# EAGLE design a_Conventional_Boost (EAGLE 9.2.2)
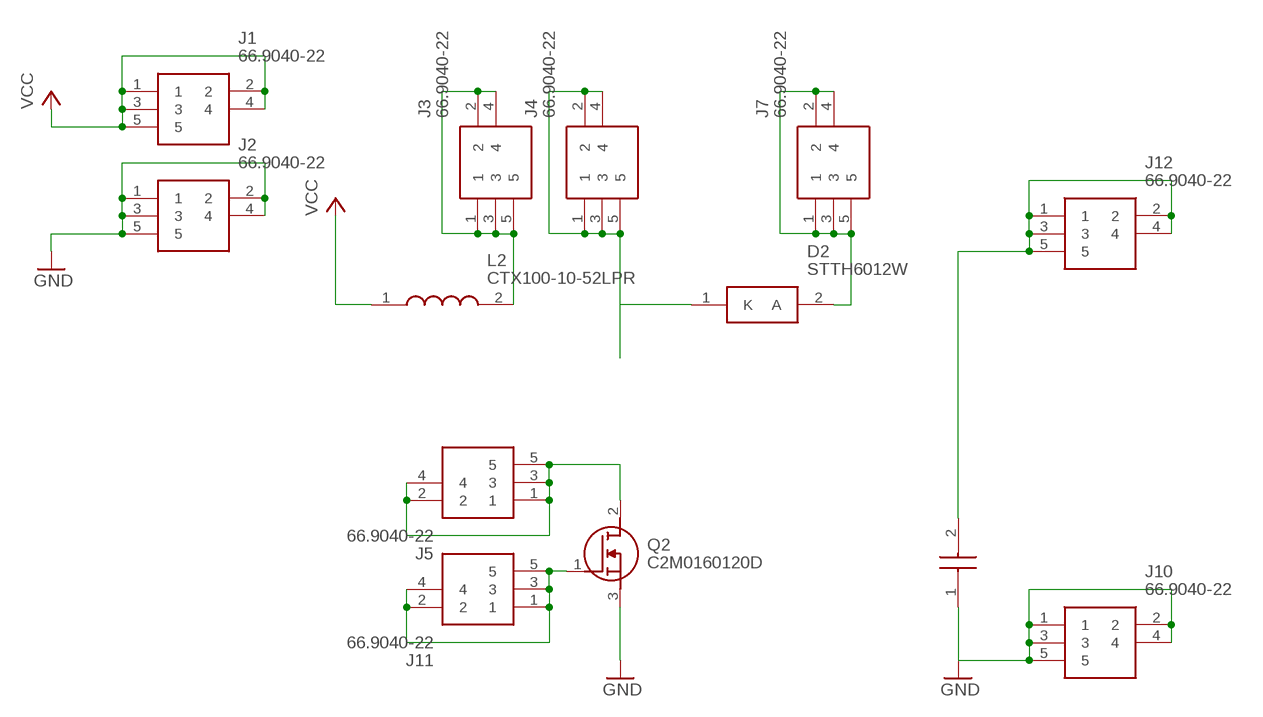
[diagram p0: schematic, sheet 1]

## Parts
D2  STTH6012W  [TO1090P515X1560X2445-2P]
J1  66.9040-22  [66904022]
J2  66.9040-22  [66904022]
J3  66.9040-22  [66904022]
J4  66.9040-22  [66904022]
J5  66.9040-22  [66904022]
J7  66.9040-22  [66904022]
J10  66.9040-22  [66904022]
J11  66.9040-22  [66904022]
J12  66.9040-22  [66904022]
L2  CTX100-10-52LPR  [CTX1001052LPR]
Q2  C2M0160120D  [TO544P521X1594X2550-3P]
U$1  B32774D4505K000  [B32774D4505K000]

## Nets
GND: J2.1 J2.2 J2.3 J2.4 J2.5 J10.1 J10.2 J10.3 J10.4 J10.5 Q2.3(S) U$1.1
GND1: J11.1 J11.2 J11.3 J11.4 J11.5 Q2.1(G)
N$2: D2.1(K) J4.1 J4.2 J4.3 J4.4 J4.5
VCC: J1.1 J1.2 J1.3 J1.4 J1.5 L2.1
VCC1: J3.1 J3.2 J3.3 J3.4 J3.5 L2.2
VCC2: J5.1 J5.2 J5.3 J5.4 J5.5 Q2.2(D)
VCC3: D2.2(A) J7.1 J7.2 J7.3 J7.4 J7.5
VCC4: J12.1 J12.2 J12.3 J12.4 J12.5 U$1.2

## Library data of the parts
D2 = SamacSys_Parts:STTH6012W: STTH6012W, Fast Recovery Rectifier Diode, Switching 60A max, 1200V 125ns, 2-Pin, DO-247 Source: Datasheet <http://www.st.com/web/en/resource/technical/document/datasheet/CD00096472.pdf>; ALLIED_NUMBER: 70014108; ALLIED_PRICE-STOCK: http://www.alliedelec.com/stmicroelectronics-stth6012w/70014108/; ARROW_PART_NUMBER: STTH6012W; ARROW_PRICE-STOCK: https://www.arrow.com/en/products/stth6012w/stmicroelectronics; DESCRIPTION: STTH6012W, Fast Recovery Rectifier Diode, Switching 60A max, 1200V 125ns, 2-Pin, DO-247; HEIGHT: 5.15mm; MANUFACTURER_NAME: STMicroelectronics; MANUFACTURER_PART_NUMBER: STTH6012W; RS_PART_NUMBER: 6870818; RS_PRICE-STOCK: http://uk.rs-online.com/web/p/rectifier-schottky-diodes/6870818/?source=DS
J1-J5 J7 J10-J12 = SamacSys_Parts:66.9040-22: STAUBLI - 66.9040-22 - SOCKET, PCB, 4MM, R/A, RED Source: Datasheet <http://www.farnell.com/datasheets/1479998.pdf>; ALLIED_NUMBER: 70749834; ALLIED_PRICE-STOCK: https://www.alliedelec.com/staubli-66-9040-22/70749834/; ARROW_PART_NUMBER: 66.9040-22; DESCRIPTION: STAUBLI - 66.9040-22 - SOCKET, PCB, 4MM, R/A, RED; HEIGHT: 11mm; MANUFACTURER_NAME: STAUBLI; MANUFACTURER_PART_NUMBER: 66.9040-22
L2 = SamacSys_Parts:CTX100-10-52LPR: Fixed Inductors 100uH 13A Source: Datasheet <http://www.cooperindustries.com/content/dam/public/bussmann/Electronics/Resources/product-datasheets/Bus_Elx_DS_PM 4304_LPCI_Series.pdf>; ARROW_PART_NUMBER: CTX100-10-52LPR; DESCRIPTION: Fixed Inductors 100uH 13A; HEIGHT: 27.5mm; MANUFACTURER_NAME: Eaton; MANUFACTURER_PART_NUMBER: CTX100-10-52LPR
Q2 = SamacSys_Parts:C2M0160120D: Wolfspeed C2M0160120D N-channel SiC MOSFET Transistor, 19 A, 1200 V, 3-Pin TO-247 Source: Datasheet <http://www.wolfspeed.com/media/downloads/169/C2M0160120D.pdf>; ARROW_PART_NUMBER: C2M0160120D; ARROW_PRICE-STOCK: http://uk.rs-online.com/web/p/products/1629709; DESCRIPTION: Wolfspeed C2M0160120D N-channel SiC MOSFET Transistor, 19 A, 1200 V, 3-Pin TO-247; HEIGHT: 5.21mm; MANUFACTURER_NAME: Wolfspeed; MANUFACTURER_PART_NUMBER: C2M0160120D; RS_PART_NUMBER: 1629709; RS_PRICE-STOCK: http://uk.rs-online.com/web/p/products/1629709
U$1 = SamacSys_Parts:B32774D4505K000: Epcos B32774D 5F Polypropylene Film Capacitor 450 V dc 10% Source: Datasheet <https://en.tdk-electronics.tdk.com/inf/20/20/db/fc_2009/MKP_B32774_778.pdf>; ARROW_PART_NUMBER: B32774D4505K000; ARROW_PRICE-STOCK: https://www.arrow.com/en/products/b32774d4505k000/epcos-tdk; DESCRIPTION: Epcos B32774D 5F Polypropylene Film Capacitor 450 V dc 10%; HEIGHT: 21mm; MANUFACTURER_NAME: EPCOS; MANUFACTURER_PART_NUMBER: B32774D4505K000; RS_PART_NUMBER: 1726009; RS_PRICE-STOCK: http://uk.rs-online.com/web/p/products/1726009

## Board
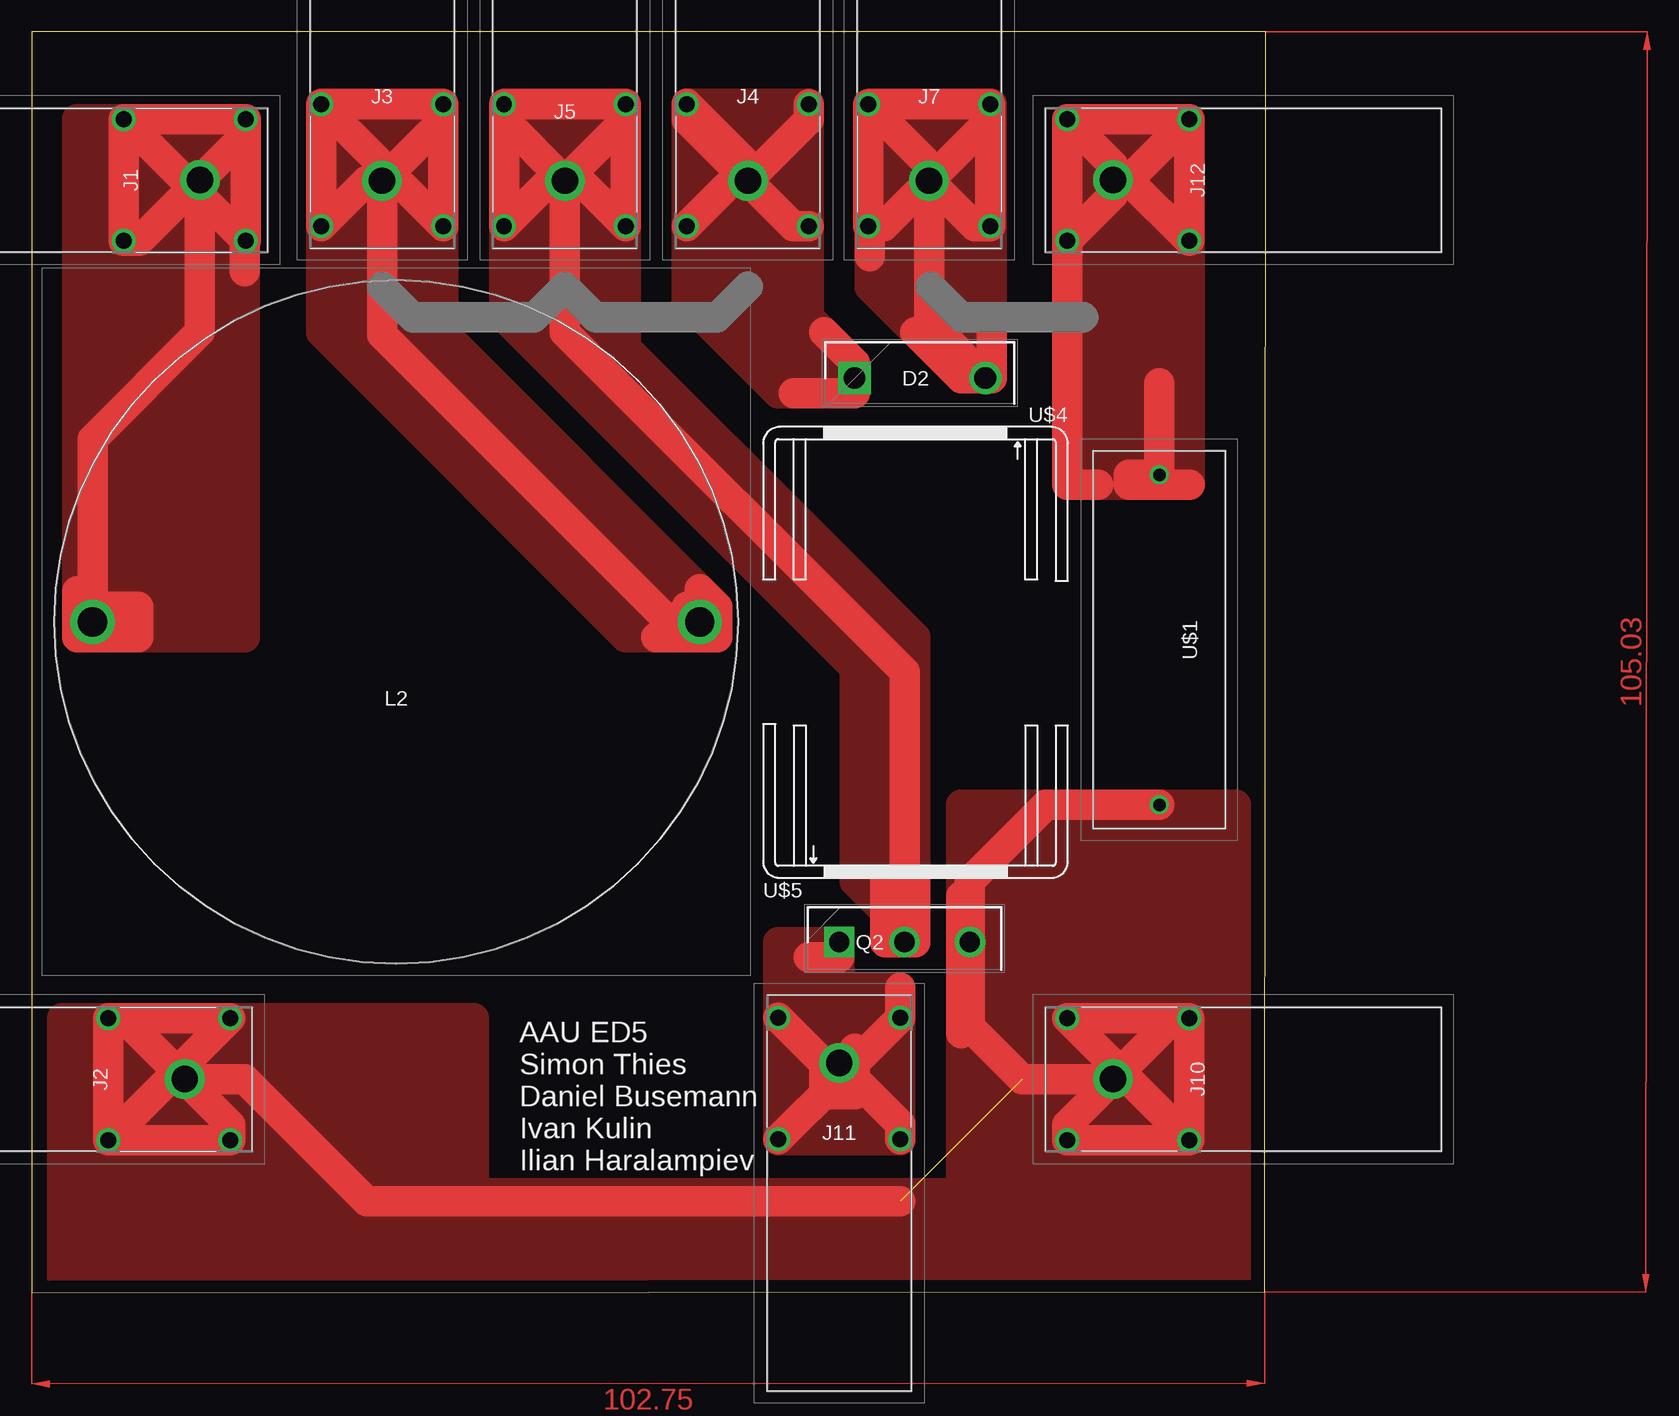
[diagram p1: board, top side]

Size 102.85 x 105.08 mm. Coordinates in mm from the lower left corner, seen from the top.
Outline: 0,0 102.75,0.05 102.85,105.08 0,105.08 0,0
Copper layers (1*16): Top 0.035mm / dielectric 1.5mm / Bottom 0.035mm
Design rules "default": minimum track width 6mil, minimum drill 0.35mm, track to track 6mil, track to pad 6mil, pad to pad 6mil, via to via 6mil, smd to smd 6mil, copper to edge 40mil, drill to drill 6mil, minimum pad ring 10mil, minimum via ring 8mil, stop-mask expansion 4mil, vias tented up to drill 0mil, thermal gap 10mil

### Footprints (pad centres in the part's own frame; a part is rotated, then mirrored left to right if it is on the bottom)
TO1090P515X1560X2445-2P = drill 1.81 pad 2.715 square: 1 0,0 | drill 1.81 pad 2.715: 2 10.9,0
66904022 = drill 1.33 pad 1.995: 1 -5.08,-14.66; 2 5.08,-14.66; 3 5.08,-4.5; 4 -5.08,-4.5 | drill 2.2 pad 3.3: 5 0,-10.86
CTX1001052LPR = drill 2.45 pad 3.675: 1 0,0; 2 50.6,0
TO544P521X1594X2550-3P = drill 1.69 pad 2.535 square: 1 0,0 | drill 1.69 pad 2.535: 2 5.44,0; 3 10.88,0
B32774D4505K000 = drill 1.05 pad 1.575: 1 0,0; 2 27.5,0

### Placement (x,y rotation side)
D2  68.58,76.2 0 top
J1  3.17,92.71 90 top
J2  1.91,17.78 90 top
J3  29.21,103.5 0 top
J4  59.69,103.5 0 top
J5  44.45,103.5 0 top
J7  74.8,103.5 0 top
J10  100.97,17.78 270 top
J11  67.31,8.25 180 top
J12  100.97,92.71 270 top
L2  5.08,55.88 0 top
Q2  67.31,29.21 0 top
U$1  93.98,40.64 90 top
U$4  [FK213]  73.66,71.12 180 top
U$5  [FK213]  73.66,35.56 0 top

### Tracks (layer width: path | path; a pad name or v marks a point on that pad's centre or on a via)
GND  (1 unrouted)
  Top 2.54: J10.5 82.55,17.78 78.19,22.14 Q2.3 | Q2.3 78.19,34.29 84.54,40.64 U$1.1 | 72.39,7.62 27.94,7.62 17.78,17.78 J2.5 | J2.4 J2.1 16.57,13.98 J2.5 | J2.4 J2.3 | J2.3 J2.2 12.77,19.06 J2.5 | J10.4 J10.1 90.11,19.06 J10.5 | J10.3 J10.2 86.31,13.98 J10.5 | J10.3 J10.4 | J10.3 91.39,17.78 J10.5 | J10.5 95.19,22.86 J10.4 | Q2.3 77.47,29.93 | 77.47,29.93 77.47,33.02 | 77.47,29.93 77.47,21.59 | J2.4 11.48,17.78 J2.5 | J2.5 7.68,22.86 J2.3
  pour Top: 77.47,40.64 100.33,40.64 100.33,1.27 77.47,1.27
  pour Top (isolate 1.016): 77.34,1.27 2.54,1.27 2.54,22.86 36.83,22.86 36.83,8.25 77.34,8.25
GND1
  Top 2.54: Q2.1 67.31,27.94 64.77,27.94 | J11.5 67.31,19.05 66.04,19.05 66.04,16.51 68.58,16.51 68.58,20.32 | J11.3 67.31,17.84 J11.5 | J11.5 72.39,14.04 J11.4 | J11.5 68.59,19.12 J11.1 72.39,25.4 | J11.5 66.03,19.12 J11.2
  pour Top (isolate 1.27): 67.31,29.21 67.31,25.4 72.39,25.4 72.39,12.7 62.23,12.7 62.23,29.21
N$2
  Top 2.54: 66.04,80.01 68.58,77.47 D2.1 68.58,74.93 63.5,74.93 | J4.5 58.41,92.64 J4.1 | J4.5 54.61,97.72 54.61,99.06 59.69,93.98 J4.5 | J4.5 64.77,97.72 J4.3 | J4.5 63.49,88.84 J4.2
  pour Top (isolate 1.27): 54.61,99.06 64.77,99.06 64.77,81.28 68.58,77.47 68.58,74.93 62.23,74.93 54.61,82.55
VCC
  Top 2.54: J1.5 14.04,80.08 5.08,71.12 5.08,57.15 8.89,57.15 8.89,54.61 3.81,54.61 3.81,55.88 | J1.1 J1.2 | J1.2 J1.3 | J1.3 J1.4 8.96,87.63 J1.5 | J1.1 17.78,87.63 17.78,85.09 | L2.1 3.81,55.88 | 3.81,55.88 3.81,58.42 | J1.5 17.84,96.51 J1.2 | J1.1 14.04,91.43 J1.5 | J1.3 12.76,92.71 J1.5
  pour Top (isolate 1.27): 17.78,97.79 3.81,97.79 3.81,54.61 17.78,54.61
VCC1
  Top 2.54: J3.5 29.21,79.81 53.14,55.88 L2.2 55.68,58.62 57.15,57.15 57.15,54.61 55.88,54.61 | J3.4 J3.1 27.93,92.64 J3.5 | J3.4 J3.3 | J3.3 J3.2 29.21,93.92 | 52.07,54.61 55.88,54.61 | 55.88,54.61 55.88,55.88 54.61,57.15 | J3.4 29.21,93.92 | 29.21,93.92 J3.5 | J3.5 34.29,97.72 J3.3
  pour Top (isolate 1.27): 24.13,99.06 34.29,99.06 34.29,80.01 57.15,57.15 57.15,54.61 49.53,54.61 24.13,80.01
VCC2
  Top 2.54: Q2.2 72.75,51.71 44.45,80.01 J5.5 | J5.3 J5.2 45.73,92.64 J5.5 | J5.3 J5.4 | J5.4 J5.1 43.17,92.64 J5.5 | Q2.2 71.12,29.21 71.12,34.29 | Q2.2 73.66,29.21 73.66,34.29 | J5.5 39.37,97.72 J5.4 | J5.5 49.53,97.72 J5.3
  pour Top (isolate 1.27): 39.37,99.06 49.53,99.06 49.53,88.9 49.53,78.74 66.04,62.23 73.66,54.61 73.66,29.21 71.12,29.21 71.12,49.53 39.37,81.28
  pour Top (isolate 1.27): 72.39,30.48 68.58,34.29 68.58,52.07
VCC3
  Top 2.54: J7.5 74.8,80.88 D2.2 | J7.1 J7.4 | J7.4 J7.3 | J7.3 J7.2 78.6,88.84 J7.5 | J7.1 69.85,88.84 | J7.5 74.8,93.92 J7.4 | J7.1 71,88.84 J7.5 | J7.3 79.88,97.72 J7.5 | D2.2 80.01,76.2 80.01,80.01 | J7.1 69.85,88.72 69.85,86.36 | D2.2 77.47,76.2 73.66,80.01
  pour Top (isolate 1.27): 69.85,99.06 80.01,99.06 80.01,76.2 77.47,76.2 69.85,83.82
VCC4
  Top 2.54: 93.98,75.76 U$1.2 91.44,68.14 91.44,67.31 96.52,67.31 | J12.2 J12.1 | J12.1 J12.4 | J12.4 J12.3 91.39,92.71 | J12.2 86.31,67.31 88.9,67.31 | J12.5 90.11,91.43 J12.2 | J12.1 90.11,93.99 J12.5 | J12.4 91.39,92.71 | 91.39,92.71 J12.5
  pour Top (isolate 1.27): 86.36,97.79 96.52,97.79 96.52,67.31 90.17,67.31 86.36,67.31
(copper drawn outside any net)
  shapes: Top area x2

### Text on the board
tNames: AAU ED5 / Simon Thies / Daniel Busemann / Ivan Kulin / Ilian Haralampiev